# EAGLE design shinobi_pwm_alpha (EAGLE 9.6.0)
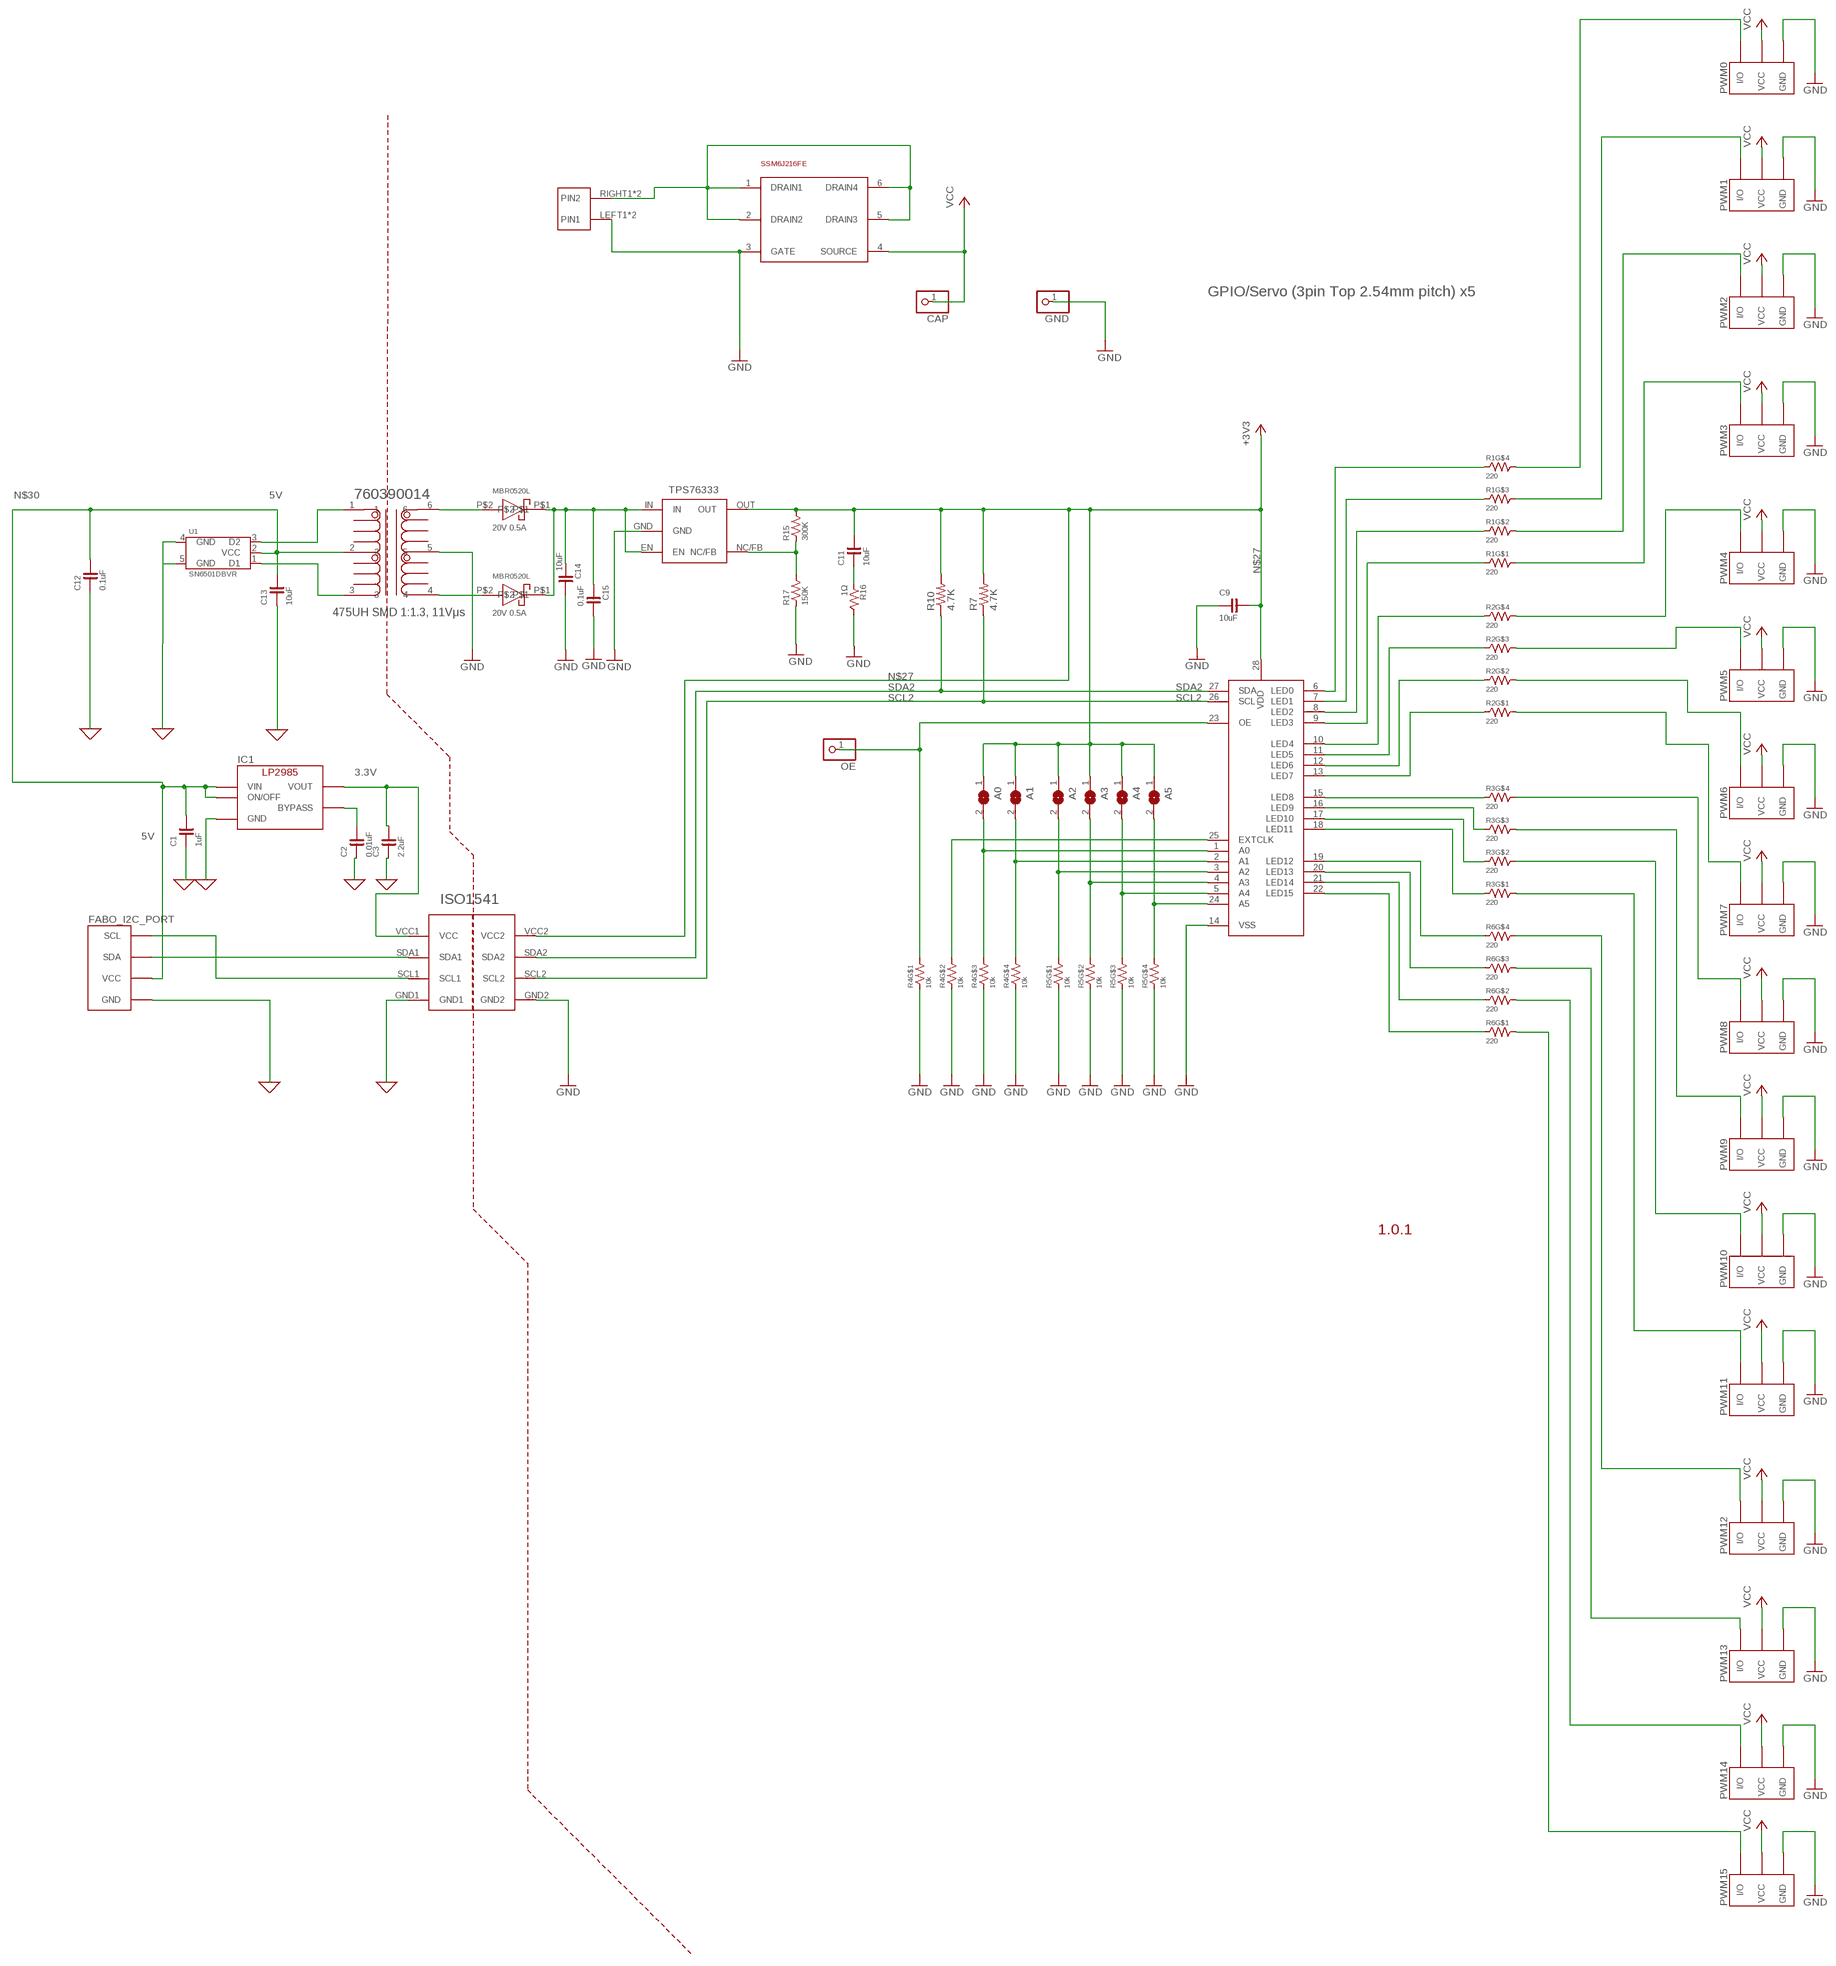
[diagram p0: schematic, sheet 1]

## Parts
A0  SJ  [SJ]
A1  SJ  [SJ]
A2  SJ  [SJ]
A3  SJ  [SJ]
A4  SJ  [SJ]
A5  SJ  [SJ]
C1  1uF  CAPACITOR-0603  [0603]
C2  0.01uF  CAPACITOR-0603  [0603]
C3  2.2uF  CAPACITOR-0603  [0603]
C9  10uF  CAPACITOR-0603  [0603]
C11  10uF  CAPACITOR-0603  [0603]
C12  0.1uF  CAPACITOR-0603  [0603]
C13  10uF  CAPACITOR-0603  [0603]
C14  10uF  CAPACITOR-0603  [0603]
C15  0.1uF  CAPACITOR-0603  [0603]
CAP  PINHD-1X1  [1X01]
D1  MBR0520L  [MBR0502L]
D2  MBR0520L  [MBR0502L]
FABO_I2C_PORT  FABO-I2C_BM04B  [I2C-BM04B-PASS-1]
GND  PINHD-1X1  [1X01]
IC1  LP2985-33DBV  [SOT-23-5]
OE  PINHD-1X1  [1X01]
PCA9685  PCA9685  [PCA9685]
PWM0  FABO_BRICK_3PIN-HEADER  [FABO_BRICK_3PIN_HEADER]
PWM1  FABO_BRICK_3PIN-HEADER  [FABO_BRICK_3PIN_HEADER]
PWM2  FABO_BRICK_3PIN-HEADER  [FABO_BRICK_3PIN_HEADER]
PWM3  FABO_BRICK_3PIN-HEADER  [FABO_BRICK_3PIN_HEADER]
PWM4  FABO_BRICK_3PIN-HEADER  [FABO_BRICK_3PIN_HEADER]
PWM5  FABO_BRICK_3PIN-HEADER  [FABO_BRICK_3PIN_HEADER]
PWM6  FABO_BRICK_3PIN-HEADER  [FABO_BRICK_3PIN_HEADER]
PWM7  FABO_BRICK_3PIN-HEADER  [FABO_BRICK_3PIN_HEADER]
PWM8  FABO_BRICK_3PIN-HEADER  [FABO_BRICK_3PIN_HEADER]
PWM9  FABO_BRICK_3PIN-HEADER  [FABO_BRICK_3PIN_HEADER]
PWM10  FABO_BRICK_3PIN-HEADER  [FABO_BRICK_3PIN_HEADER]
PWM11  FABO_BRICK_3PIN-HEADER  [FABO_BRICK_3PIN_HEADER]
PWM12  FABO_BRICK_3PIN-HEADER  [FABO_BRICK_3PIN_HEADER]
PWM13  FABO_BRICK_3PIN-HEADER  [FABO_BRICK_3PIN_HEADER]
PWM14  FABO_BRICK_3PIN-HEADER  [FABO_BRICK_3PIN_HEADER]
PWM15  FABO_BRICK_3PIN-HEADER  [FABO_BRICK_3PIN_HEADER]
R1  220  RESISTOR_ARRAY  [EXBV8V]
R2  220  RESISTOR_ARRAY  [EXBV8V]
R3  220  RESISTOR_ARRAY  [EXBV8V]
R4  10k  RESISTOR_ARRAY  [EXBV8V]
R5  10k  RESISTOR_ARRAY  [EXBV8V]
R6  220  RESISTOR_ARRAY  [EXBV8V]
R7  4.7K  R-US_R0402  [R0402]
R10  4.7K  R-US_R0402  [R0402]
R15  300K  RESISTOR-0603  [0603]
R16  1Ω  RESISTOR-0603  [0603]
R17  150K  RESISTOR-0603  [0603]
SSM6J216FE  SSM6J216FE  [SSM6J216FE]
U1  SN6501DBVR  [SOT-23-5]
U$5  ML-1400-S1  [ML-1400-S1]
U$6  760390014  [760390014]
U$8  TPS76333  [TPS76333]
U$18  ISO1541  [ISO1541]

## Nets
0: C1.1 C2.1 C3.1 C12.1 C13.1 FABO_I2C_PORT.GND IC1.2(GND) U1.4(GND) U1.5(GND) U$18.GND1 ; supply symbol labelled GND
GND: C9.1 C14.2 C15.2 GND.1 PCA9685.14(VSS) PWM0.GND PWM1.GND PWM2.GND PWM3.GND PWM4.GND PWM5.GND PWM6.GND PWM7.GND PWM8.GND PWM9.GND PWM10.GND PWM11.GND PWM12.GND PWM13.GND PWM14.GND PWM15.GND R4.1 R4.2 R4.3 R4.4 R5.1 R5.2 R5.3 R5.4 R16.2 R17.1 SSM6J216FE.3(GATE) U$5.LEFT1(PIN1) U$5.LEFT2(PIN1) U$6.5 U$8.GND U$18.GND2
N$1: OE.1 PCA9685.23(OE) R4.8
N$2: PCA9685.25(EXTCLK) R4.7
N$3: A0.2 PCA9685.1(A0) R4.6
N$4: A1.2 PCA9685.2(A1) R4.5
N$5: A2.2 PCA9685.3(A2) R5.8
N$6: A3.2 PCA9685.4(A3) R5.7
N$7: A4.2 PCA9685.5(A4) R5.6
N$8: A5.2 PCA9685.24(A5) R5.5
N$9: PCA9685.6(LED0) R1.4
N$10: PCA9685.7(LED1) R1.3
N$11: PCA9685.8(LED2) R1.2
N$12: PWM4.I/O R2.5
N$13: PCA9685.10(LED4) R2.4
N$14: PCA9685.11(LED5) R2.3
N$15: PCA9685.12(LED6) R2.2
N$16: PCA9685.13(LED7) R2.1
N$17: PCA9685.9(LED3) R1.1
N$18: PCA9685.16(LED9) R3.3
N$19: PCA9685.17(LED10) R3.2
N$20: PCA9685.18(LED11) R3.1
N$21: PCA9685.19(LED12) R6.4
N$22: PCA9685.20(LED13) R6.3
N$23: PCA9685.21(LED14) R6.2
N$24: PCA9685.22(LED15) R6.1
N$25: PWM11.I/O R3.8
N$26: C11.1 R16.1
N$27: A0.1 A1.1 A2.1 A3.1 A4.1 A5.1 C9.2 C11.2 PCA9685.28(VDD) R7.2 R10.2 R15.2 U$8.OUT U$18.VCC2 ; supply symbol labelled +3V3
N$29: SSM6J216FE.1(DRAIN1) SSM6J216FE.2(DRAIN2) SSM6J216FE.5(DRAIN3) SSM6J216FE.6(DRAIN4) U$5.RIGHT1(PIN2) U$5.RIGHT2(PIN2)
N$30: C1.2 C12.2 C13.2 FABO_I2C_PORT.5V(VCC) IC1.1(VIN) IC1.3(ON/OFF) U1.2(VCC) U$6.2
N$31: PWM0.I/O R1.5
N$33: PWM1.I/O R1.6
N$34: PWM2.I/O R1.7
N$35: PCA9685.15(LED8) R3.4
N$36: PWM3.I/O R1.8
N$37: PWM5.I/O R2.6
N$38: PWM6.I/O R2.7
N$39: PWM7.I/O R2.8
N$40: PWM8.I/O R3.5
N$41: PWM9.I/O R3.6
N$42: PWM10.I/O R3.7
N$43: PWM12.I/O R6.5
N$44: PWM13.I/O R6.6
N$45: PWM14.I/O R6.7
N$46: PWM15.I/O R6.8
N$47: D1.P$2 U$6.6
N$48: U1.3(D2) U$6.1
N$49: U1.1(D1) U$6.3
N$50: C14.1 C15.1 D1.P$1 D2.P$1 U$8.EN U$8.IN
N$51: D2.P$2 U$6.4
N$52: C2.2 IC1.4(BYPASS)
N$53: C3.2 IC1.5(VOUT) U$18.VCC1(VCC)
N$55: R15.1 R17.2 U$8.NC/FB
SCL1: FABO_I2C_PORT.SCL U$18.SCL1
SCL2: PCA9685.26(SCL) R7.1 U$18.SCL2
SDA1: FABO_I2C_PORT.SDA U$18.SDA1
SDA2: PCA9685.27(SDA) R10.1 U$18.SDA2
VCC: CAP.1 PWM0.VCC PWM1.VCC PWM2.VCC PWM3.VCC PWM4.VCC PWM5.VCC PWM6.VCC PWM7.VCC PWM8.VCC PWM9.VCC PWM10.VCC PWM11.VCC PWM12.VCC PWM13.VCC PWM14.VCC PWM15.VCC SSM6J216FE.4(SOURCE)

## Notes on the sheet
- GPIO/Servo (3pin Top 2.54mm pitch) x5
- 5V
- 3.3V
- 5V
- 1.0.1

## Library data of the parts
A0 A1-A5 = jumper:SJ: SMD solder JUMPER
C1-C3 C9 C11-C15 = FaBo-Capacitor:CAPACITOR: CAPACITOR
CAP GND OE = pinhead:PINHD-1X1: PIN HEADER
D1 D2 = FaBo:MBR0520L
FABO_I2C_PORT = FaBo-Connetor:FABO-I2C
IC1 = FaBo-Supply:LP2985: LP2985
PCA9685 = FaBo-Motor:PCA9685
PWM0 PWM1-PWM15 = FaBo-Template:FABO_BRICK_3PIN: FaBo Brick 3pin
R1-R6 = component:RESISTOR_ARRAY
R7 R10 = rcl:R-US_: RESISTOR, American symbol; SPICEPREFIX: R
R15-R17 = FaBo-Resistors:RESISTOR: RESISTOR
SSM6J216FE = FaBo-Supply:SSM6J216FE
U1 = TI:SN6501
U$5 = FaBo-Terminal:ML-1400-S1
U$6 = FaBo:760390014
U$8 = FaBo:TPS76333
U$18 = FaBo:ISO1541

## Board
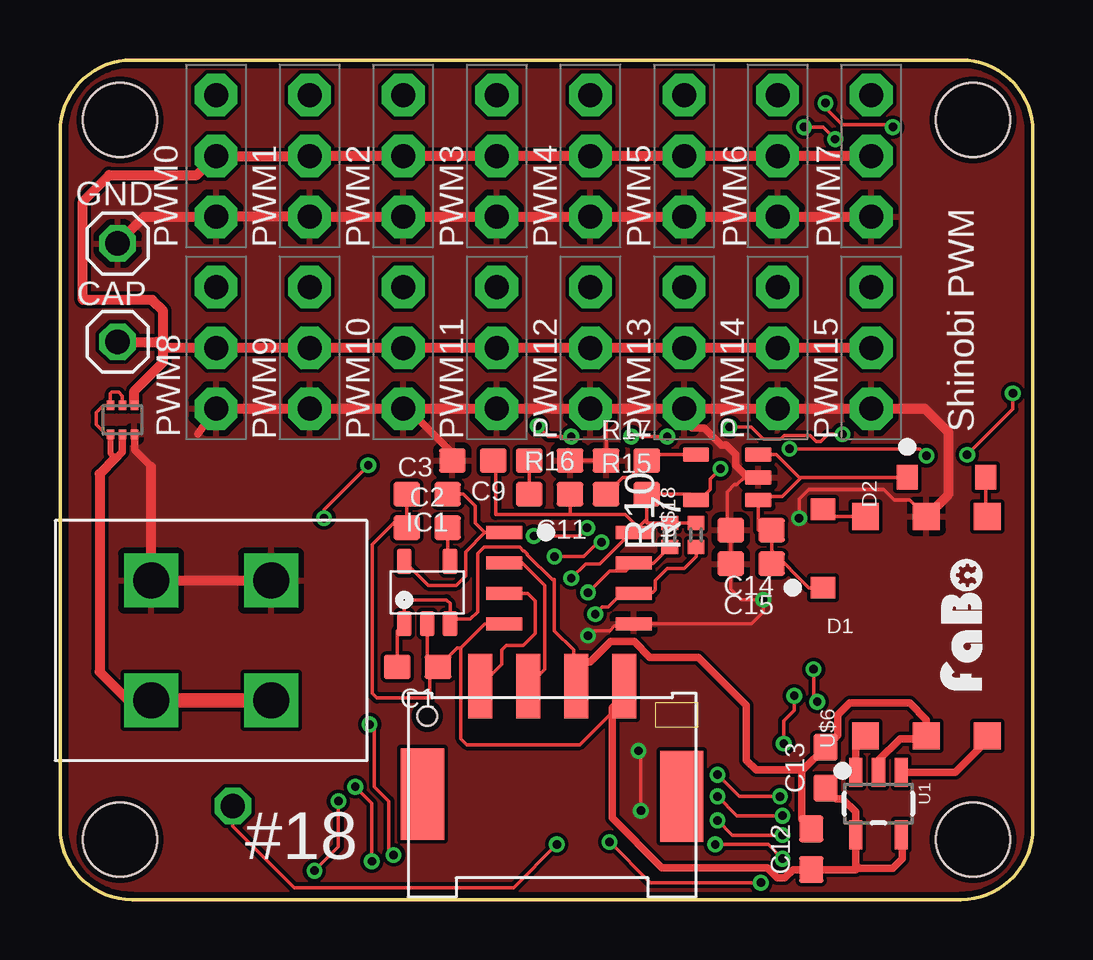
[diagram p1: board, top side]
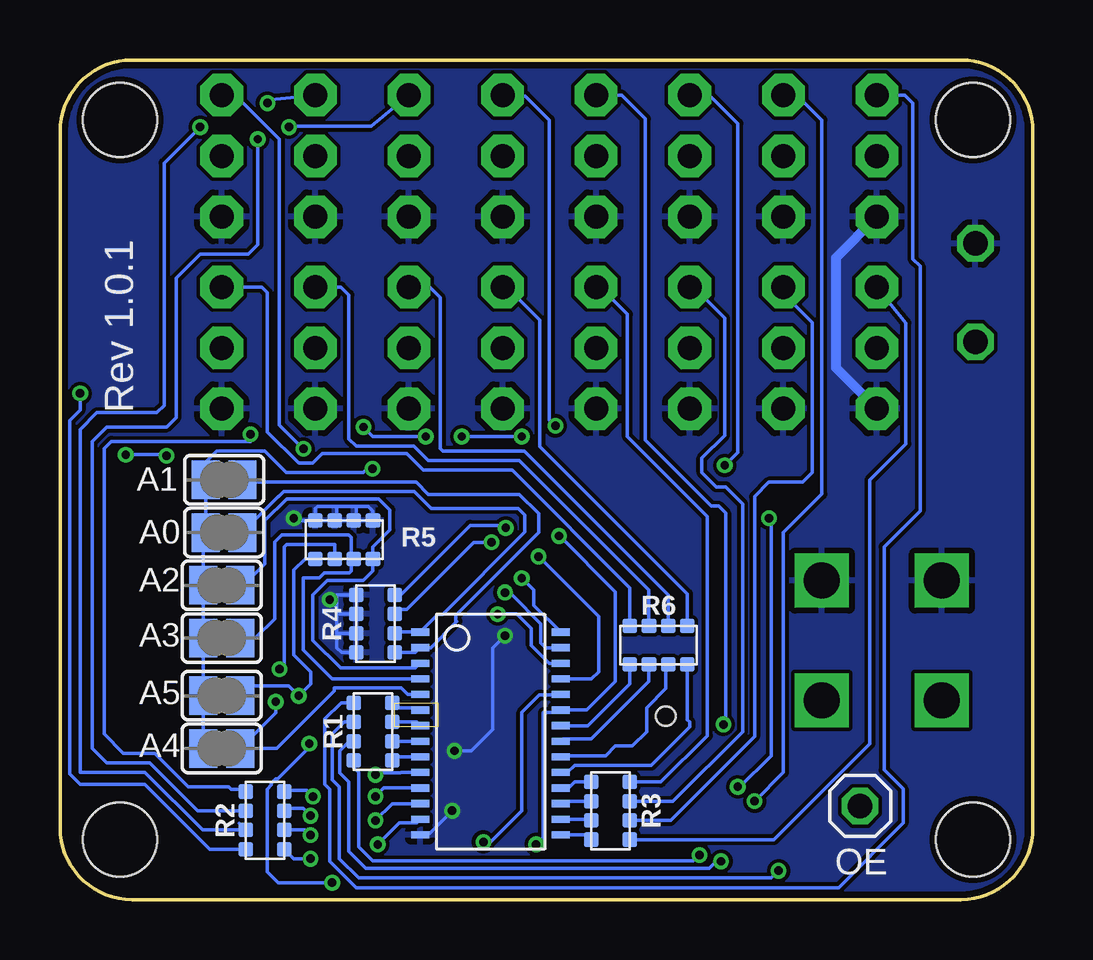
[diagram p2: board, bottom side, seen from below]

Size 40.54 x 35 mm. Coordinates in mm from the lower left corner, seen from the top.
Copper layers (1*16): Top 0.035mm / dielectric 1.5mm / Bottom 0.035mm
Design rules "SeeedStudio_2layer_DRU_no_angle_20140221": minimum track width 6mil, minimum drill 12mil, track to track 6mil, track to pad 6mil, pad to pad 6mil, via to via 6mil, smd to smd 0mil, copper to edge 10mil, drill to drill 10mil, minimum pad ring 10mil, minimum via ring 6mil, stop-mask expansion 2mil, vias tented up to drill 100mil, thermal gap 10mil

### Footprints (pad centres in the part's own frame; a part is rotated, then mirrored left to right if it is on the bottom)
SJ = smd 1.168 x 1.6: 1 -0.762,0; 2 0.762,0
0603 = smd 1.1 x 1: 1 -0.85,0; 2 0.85,0
1X01 = drill 1.016 octagon: 1 0,0
MBR0502L = smd 1.02 x 0.88: P$1 0,0; P$2 0,-3.27
I2C-BM04B-PASS-1 = smd 1 x 2.7: 5V -1,0; GND -3,0; SCL 3,0; SDA 1,0 | smd 1.8 x 3.8: P$5 -5.4,4.6; P$6 5.4,4.5 | hole 0.8: 5.2,1.25
SOT-23-5 = smd 0.6 x 1.05: 1 -0.95,-1.3; 2 0,-1.3; 3 0.95,-1.3; 4 0.95,1.3; 5 -0.95,1.3
PCA9685 = smd 0.3 x 0.75: 1 -4.15,-2.93; 2 -3.5,-2.93; 3 -2.85,-2.93; 4 -2.2,-2.93; 5 -1.55,-2.93; 6 -0.9,-2.93; 7 -0.25,-2.93; 8 0.4,-2.93; 9 1.05,-2.93; 10 1.7,-2.93; 11 2.35,-2.93; 12 3,-2.93; 13 3.65,-2.93; 14 4.3,-2.93; 15 4.3,2.92; 16 3.65,2.92; 17 3,2.92; 18 2.35,2.92; 19 1.7,2.92; 20 1.05,2.92; 21 0.4,2.92; 22 -0.25,2.92; 23 -0.9,2.92; 24 -1.55,2.92; 25 -2.2,2.92; 26 -2.85,2.92; 27 -3.5,2.92; 28 -4.15,2.92
FABO_BRICK_3PIN_HEADER = drill 1 pad 1.778 octagon: GND -2.54,0; I/O 2.54,0; VCC 0,0
EXBV8V = smd 0.6 x 0.6: 1 -1.2,-0.8; 2 -0.4,-0.8; 3 0.4,-0.8; 4 1.2,-0.8; 5 1.2,0.8; 6 0.4,0.8; 7 -0.4,0.8; 8 -1.2,0.8
R0402 = smd 0.6 x 0.7: 1 -0.5,0; 2 0.5,0
SSM6J216FE = smd 0.3 x 0.4: 1 -0.5,-0.6; 2 0,-0.6; 3 0.5,-0.6; 4 0.5,0.6; 5 0,0.6; 6 -0.5,0.6
SOT-23-5' = smd 1.2 x 0.55: 1 -1.3,0.95; 2 -1.3,0; 3 -1.3,-0.95; 4 1.3,-0.95; 5 1.3,0.95
FABO-SHINOBI = hole 3.1: 2.5,32.5; 38.04,32.5; 38.04,2.5; 2.5,2.5
ML-1400-S1 = drill 1.5 square: LEFT1 -2.5,2.5; LEFT2 -2.5,-2.5; RIGHT1 2.5,2.5; RIGHT2 2.5,-2.5
760390014 = smd 1.12 x 1.118: 1 -4.57,2.54; 2 -4.57,0; 3 -4.57,-2.54; 4 4.57,-2.54; 5 4.57,0; 6 4.57,2.54
TPS76333 = smd 1.1 x 0.6: EN -1.3,-0.95; GND -1.3,0; IN -1.3,0.95; NC/FB 1.3,-0.95; OUT 1.3,0.95
ISO1541 = smd 0.55 x 1.5: GND1 1.905,-2.7; GND2 1.905,2.7; SCL1 0.635,-2.7; SCL2 0.635,2.7; SDA1 -0.635,-2.7; SDA2 -0.635,2.7; VCC1 -1.905,-2.7; VCC2 -1.905,2.7

### Placement (x,y rotation side)
A0  33.7,15.3 0 bottom
A1  33.7,17.5 0 bottom
A2  33.8,13.1 0 bottom
A3  33.8,10.9 0 bottom
A4  33.8,6.3 0 bottom
A5  33.8,8.5 0 bottom
C1  14.9,9.7 180 top
C2  15.3,15.5 0 top
C3  15.3,16.9 0 top
C9  17.2,18.3 0 top
C11  20.4,16.9 0 top
C12  31.3,2.1 90 top
C13  31.9,5.5 90 top
C14  28.8,15.4 180 top
C15  28.8,14 180 top
CAP  2.4,23.25 0 top
D1  31.8,13 180 top
D2  35.3,17.6 90 top
FABO_I2C_PORT  20.5,8.9 180 top
GND  2.4,27.35 0 top
IC1  15.3,12.8 0 top
OE  7.2,3.9 0 bottom
PCA9685  22.6,7 270 bottom
PWM0  6.5,31 90 top
PWM1  10.4,31 90 top
PWM2  14.3,31 90 top
PWM3  18.2,31 90 top
PWM4  22.1,31 90 top
PWM5  26,31 90 top
PWM6  29.9,31 90 top
PWM7  33.8,31 90 top
PWM8  6.5,23 90 top
PWM9  10.4,23 90 top
PWM10  14.3,23 90 top
PWM11  18.2,23 90 top
PWM12  22.1,23 90 top
PWM13  26,23 90 top
PWM14  29.9,23 90 top
PWM15  33.8,23 90 top
R1  27.5,7 90 bottom
R2  32,3.3 90 bottom
R3  17.6,3.7 270 bottom
R4  27.4,11.5 270 bottom
R5  28.7,15 180 bottom
R6  15.6,10.6 0 bottom
R7  26.5,15.2 90 top
R10  25.4,15.2 90 top
R15  23.6,16.9 0 top
R16  20.4,18.3 0 top
R17  23.6,18.3 0 top
SSM6J216FE  2.6,20 0 top
U1  SN6501DBVR  [SOT-23-5']  34.1,4 270 top
U$1  [FABO-SHINOBI]  0,0 0 top
U$2  [LOGO_FABO_S]  38.58,11.52 90 top
U$5  6.3,10.8 270 top
U$6  36.1,11.4 90 top
U$8  27.8,17.6 180 top
U$18  21.2,13.4 270 top

### Tracks (layer width: path | path; a pad name or v marks a point on that pad's centre or on a via)
0
  Top 0.152: 31.15,1.4 C12.1 31.12,1.07 31.05,1 | 23.5,8.5 FABO_I2C_PORT.GND | C1.1 15.3,10.15 IC1.2 | 16.7,10.5 16.7,6.7 16.95,6.45 21.65,6.45 23,7.8 | C3.1 14.45,15.7 | 14.45,15.7 C2.1 | C1.1 16.55,10.5 16.7,10.5 | C1.1 15.4,9.35 15.4,8.4 13.2,8.4 13,8.6 13,14.8 13.9,15.7 14.45,15.7 | 16.7,10.5 17.7,11.49 U$18.GND1
  Top 0.305: 31.25,1.2 31.12,1.07 | 23.6,8.8 FABO_I2C_PORT.GND | 33.25,1.35 33.15,1.45 U1.4 33.15,3.65 32.6,4.2 32.35,4.2 C13.1 | 33.25,1.35 33.3,1.3 34.7,1.3 35.1,1.7 35.1,2.65 U1.5 | 33.25,1.35 33.15,1.25 C12.1 30.55,1.25 30.2,0.9 29.89,0.9 29.46,1.33 25.07,1.33 23,3.4 23,7.8 23,8 23.5,8.5
GND  (via drill 0.35)
  Top 0.152: 29.1,17.4 U$8.GND 28.5,17.6 28.2,17.3 28.1,17.3 27.8,17 27.8,15.55 C14.2 C15.2 27.95,12.95 28.4,12.5 v29.3,12.5 29.3,12 28.8,11.49 U$18.GND2 | 36.5,16.37 U$6.5 35.41,16.66 34.77,16.66 34.33,17.1 31.2,17.1 30.8,16.7 v30.8,15.9 | 24.41,11.49 U$18.GND2 | R16.2 22.55,18.3 22.68,18.18 | 22.75,20.41 22.7,20.46 | v24.2,3.7 24.2,6.1 v24.1,6.2 | v22,11 22.2,11.2 22.9,11.2 23.1,11.4 23.8,11.4 U$18.GND2 | R17.1 22.75,19.91 22.2,20.46
  Top 0.305: PWM8.GND 5.74,19.4 | PWM10.GND 14.77,20.39 14.7,20.26 16.35,18.61 C9.1 | 22.5,18.35 22.68,18.18 22.68,18.23 R17.1 | U$8.GND 28.65,17.6 28.15,18.1 28.15,18.55 27.75,18.95 27.55,18.95 26.85,19.65 26.35,19.65 26.2,19.8 PWM13.GND | 3.9,13.4 U$5.LEFT2 | SSM6J216FE.3 3.11,18.74 3.8,18.05
  Top 0.406: PWM7.GND PWM6.GND PWM5.GND PWM4.GND PWM3.GND PWM2.GND PWM1.GND PWM0.GND 3.51,28.46 GND.1 | U$6.5 37,16.87 37,19.5 36.04,20.46 PWM15.GND PWM14.GND PWM13.GND PWM12.GND | PWM8.GND PWM9.GND 14.7,20.46 14.77,20.39 | PWM10.GND PWM11.GND 19.89,20.46 19.92,20.48 20.48,20.48 20.51,20.46 PWM12.GND | 22.2,20.46 PWM12.GND | U$5.LEFT1 U$5.LEFT2 3.8,18.05
  Bottom 0.152: R4.1 29,12.7 29,12.2 | 29,12.2 29,11.9 | 29,11.9 29,11.1 | R4.3 29,11.1 | R4.2 29,11.9 | 28.2,16.39 29,16.39 | 29,16.39 29.8,16.39 29.9,16.3 R5.4 30.7,15.8 v30.8,15.9 | R5.3 29,15.9 29,16.39 | R5.2 28.2,15.9 28.2,16.39 | PCA9685.14 25.2,2.7 v24.2,3.7 | v22,11 22.5,10.5 22.5,7.1 23.4,6.2 v24.1,6.2 | 29,12.2 v29.3,12.5 | R4.4 28.8,10.3 29,10.5 29,11.1 | R5.1 27.5,16.2 27.7,16.39 28.2,16.39
  Bottom 0.406: PWM8.GND 8.2,22.16 8.2,26.76 PWM0.GND
  pour Bottom: 0.4,0.3 40.2,0.3 40.2,34.6 0.4,34.6
  pour Top: 0.4,0.3 40.2,0.3 40.2,34.6 0.4,34.6
N$1  (via drill 0.35)
  Top 0.152: v19.74,15.16 21.63,15.16 v21.97,15.49 | v20.7,2.3 18.9,0.5 9.75,0.5 7.2,3.05 OE.1
  Bottom 0.152: 19.74,15.17 17.4,12.83 17.4,9.1 18.6,7.9 PCA9685.23 19.78,7.8 20.4,7.8 20.4,2.6 v20.7,2.3 | 26.7,12.7 R4.8 26.35,12.7 23.46,15.59 22.07,15.59 v21.97,15.49 | 19.77,15.2 19.74,15.17 | 19.74,15.17 v19.74,15.16
N$2  (via drill 0.35)
  Top 0.152: v20.6,14.3 21.81,14.3 22.41,14.89 v22.56,14.89
  Bottom 0.152: PCA9685.25 18.4,9.2 18.1,9.5 18.1,11.8 v20.6,14.3 | 26.4,11.9 R4.7 26.4,12.1 26.1,12.1 23.31,14.89 v22.56,14.89
N$3
  Bottom 0.152: R4.6 26.55,11.15 PCA9685.1 24.8,11.88 24.6,11.88 21.17,15.32 21.17,16.03 21.44,16.3 25.07,16.3 25.77,17 31.23,17 31.43,16.8 31.44,16.8 A0.2
N$4
  Bottom 0.152: R4.5 25.73,10.3 PCA9685.2 25.1,10.5 24.05,11.55 | A1.2 32.84,17.4 25.7,17.4 25.2,16.89 21.39,16.89 20.6,16.1 20.6,15.3 24.05,11.85 24.05,11.55 | 24.05,11.55 24,11.6
N$5
  Bottom 0.152: PCA9685.3 25.73,9.65 28.85,9.65 30,10.8 30,12.7 29.4,13.3 27.9,13.3 27.5,13.7 R5.8 27.5,14.7 26.8,15.4 26.8,16.25 27.25,16.7 31.1,16.7 32,15.8 32,14 32.9,13.1 A2.2
N$6
  Bottom 0.152: PCA9685.4 29.2,9.2 30.4,10.4 30.4,13.4 29.73,13.4 29.53,13.61 28.5,13.61 28.4,13.7 28.4,14.1 R5.7 | 28.5,14.2 R5.7 | R5.7 28.4,14.3 28.4,15.1 28.5,15.21 30.83,15.21 30.83,15.2 31.3,15.2 31.6,14.9 31.6,11.7 32.4,10.9 A3.2
N$7  (via drill 0.35)
  Top 0.152: v31.4,9.6 31.4,8.39 v31.55,8.24
  Bottom 0.152: R5.6 29.1,14.8 31.1,14.8 31.2,14.7 31.2,9.8 v31.4,9.6 | PCA9685.5 26.05,8.55 26.33,8.83 29.11,8.83 29.11,8.69 31.5,6.3 A4.2 31.55,7.79 v31.55,8.24
N$8  (via drill 0.35)
  Top 0.152: v22.9,2.4 24.59,0.71 v29.19,0.71 v29.2,0.7 | v30.16,6.5 30.16,7.46 30.59,7.89 v30.59,8.49
  Bottom 0.152: PCA9685.24 19.7,8.53 20.57,8.53 21.3,7.8 21.3,3.7 22.6,2.4 v22.9,2.4 | v29.2,0.7 v29.21,0.71 31.46,0.71 31.9,1.15 31.9,4.6 31.73,4.77 31.73,4.84 31.54,5.03 31.47,5.03 30.16,6.34 v30.16,6.5 | R5.5 30.33,14.2 30.8,13.73 30.8,10.2 30.1,9.5 30.1,8.99 v30.59,8.49 31,8.9 32.64,8.9 A5.2 33.04,8.3 | 33.04,8.16 33.04,8.3 | 32.54,8.8 33.04,8.3
N$9
  Bottom 0.152: PCA9685.6 25.63,8 26.5,8 R1.4
N$10
  Bottom 0.152: PCA9685.7 25.68,7.4 R1.3
N$11
  Bottom 0.152: PCA9685.8 R1.2
N$12  (via drill 0.35)
  Top 0.152: v19.9,19.75 20.35,19.3 v21.3,19.3 | v25.3,19.3 v23.8,19.3 | v27.9,19.7 28.8,19.7 29.3,19.2 30.03,19.2 30.17,19.34 31.26,19.34 31.51,19.09 31.7,19.09 32.01,19.4 v32.6,19.4
  Bottom 0.152: PWM4.I/O 22.48,33.5 21.15,33.5 20.15,32.5 20.15,20 v19.9,19.75 | R2.5 32.9,4.6 33.4,4.6 33.5,4.7 35.2,4.7 36.6,6.1 37.9,6.1 38.7,6.9 38.7,18.8 38.4,19.1 32.6,19.1 v32.6,19.4 | v21.3,19.3 v23.8,19.3 | v25.3,19.3 27.5,19.3 v27.9,19.7
N$13  (via drill 0.35)
  Top 0.152: v27.4,5.2 28.3,4.3 v30,4.3
  Bottom 0.152: v27.4,5.2 27.3,5.3 27.07,5.3 27.04,5.27 26.36,5.27 26.33,5.3 PCA9685.10 | R2.4 31.15,4.55 30.25,4.55 v30,4.3
N$14  (via drill 0.35)
  Top 0.152: v27.4,4.3 28.21,3.49 v30.1,3.49
  Bottom 0.152: PCA9685.11 27.05,4.65 v27.4,4.3 | 30.99,3.49 R2.3 31.1,3.8 30.41,3.8 v30.1,3.49
N$15  (via drill 0.35)
  Top 0.152: v27.4,3.3 28.01,2.69 v30.1,2.69
  Bottom 0.152: PCA9685.12 26.7,4 v27.4,3.3 | v30.1,2.69 30.31,2.9 R2.2
N$16  (via drill 0.35)
  Top 0.152: v27.3,2.3 29.5,2.3 v30.1,1.7
  Bottom 0.152: PCA9685.13 25.68,3.2 26.4,3.2 v27.3,2.3 | v30.1,1.7 30.8,1.7 R2.1
N$17
  Bottom 0.152: R1.1 26.55,5.95 PCA9685.9
N$18
  Bottom 0.152: PCA9685.16 18.45,3.35 R3.3
N$19
  Bottom 0.152: 19.46,4 PCA9685.17 19.58,4.1 R3.2
N$20
  Bottom 0.152: R3.1 19.1,4.9 19.35,4.65 PCA9685.18
N$21
  Bottom 0.152: PCA9685.19 19.4,5.3 19.1,5.6 15.9,5.6 14.3,7.2 14.3,7.4 14.4,7.5 R6.4
N$22
  Bottom 0.152: PCA9685.20 19.65,5.95 19.6,6 17.8,6 17.4,6.4 16.7,6.4 16.1,7 16.1,8 15.3,8.8 15.3,9.7 R6.3
N$23
  Bottom 0.152: PCA9685.21 19.58,6.7 18.4,6.7 16,9.1 R6.2
N$24
  Bottom 0.152: R6.1 16.8,9 18.55,7.25 PCA9685.22
N$25
  Bottom 0.152: PWM11.I/O 18.16,25.1 17.6,25.1 16.9,24.4 16.9,19.3 13.57,15.97 13.57,6.83 15.5,4.9 R3.8
N$26
  Top 0.152: R16.1 C11.1
N$27  (via drill 0.35)
  Top 0.152: U$8.OUT 26.25,16.9 R15.2 24.45,15.86 | U$8.OUT 26.3,16.45 | U$18.VCC2 24.45,15.86 | 24.45,15.86 24.45,15.7 R10.2 R7.2 | U$18.VCC2 23.9,15.7 23.55,16.05 21.25,16.05 | 21.25,16.05 C11.2 | 21.25,16.05 18.15,16.05 18.15,18.2 C9.2 | U$8.OUT 26.57,16.57 27.1,17.1 27.1,17.54 v27.52,17.96 | v21.3,13.4 21.9,14 22.5,14 23.8,15.3 U$18.VCC2
  Bottom 0.152: PCA9685.28 20.8,12.27 20.8,12.9 v21.3,13.4 | v27.52,17.96 27.75,17.96 27.9,17.8 31.11,17.8 32,18.7 34,18.7 34.46,18.24 A1.1 A0.1 34.56,15.2 A2.1 A3.1 A5.1 A4.1
N$29
  Top 0.152: SSM6J216FE.1 1.9,19.4 1.5,19.8 1.5,20.3 1.8,20.6 SSM6J216FE.6 2.1,21.1 2.15,21.15 2.45,21.15 2.6,21 SSM6J216FE.5
  Top 0.254: SSM6J216FE.1 2.1,18.6 2.3,18.4 2.33,18.38
  Top 0.305: SSM6J216FE.2 2.6,18.65 2.33,18.38
  Top 0.406: 2.3,18.4 1.65,17.75 1.65,9.5 2.85,8.3 4.1,8.3
  Top 0.61: U$5.RIGHT2 4.1,8.3 U$5.RIGHT1
N$30
  Top 0.152: FABO_I2C_PORT.5V 21.6,9 | FABO_I2C_PORT.5V 21.1,8.5 | 36.1,6.63 36.1,6.7 U$6.2 | C1.2 14.05,11.2 IC1.1 14.35,12.25 14.6,12.5 16.1,12.5 16.25,12.35 IC1.3 16.45,11.7 17.1,11.7 17.4,12 17.4,14.43 17.67,14.7 19.15,14.7 19.31,14.54 19.34,14.54 19.48,14.4 19.48,14.37 20.5,13.35 20.6,13.35 20.6,11.2 21.4,10.4 21.4,9.9 21.4,9 FABO_I2C_PORT.5V
  Top 0.2: 36.2,6.53 36.1,6.63
  Top 0.305: 31.55,2.7 C12.2 30.9,3.35 30.9,5.3 30.8,5.4 | 21.4,9.9 22.1,9.9 22.95,10.76 23.93,10.76 24.58,10.1 26.6,10.1 28.6,8.1 28.6,5.8 29,5.4 30.8,5.4 | U1.2 34.1,5.8 35,6.7 36.1,6.7 36.1,7.5 35.4,8.2 32.9,8.2 32.4,7.7 32.4,6.85 C13.2 30.95,5.4 30.8,5.4
N$31
  Bottom 0.152: PWM0.I/O 5.34,33.54 5,33.2 5,26.7 4.7,26.4 4.7,16.2 6.2,14.7 6.2,5.4 5.41,4.61 5.41,3.19 8.1,0.5 28.2,0.5 29.3,1.6 29.3,4.6 29.5,4.8 29.5,7.53 28.83,8.2 R1.5
N$33  (via drill 0.35)
  Top 0.152: v11.6,4.1 11.6,2.2 v10.6,1.2
  Bottom 0.152: v10.6,1.2 10.9,0.9 28.1,0.9 28.9,1.7 28.9,4.7 29.2,5 29.2,6.9 28.7,7.4 R1.6 | v11.6,4.1 10.4,5.3 10.4,15.3 8.8,16.9 8.8,32.5 9.65,33.35 10.81,33.35 PWM1.I/O
N$34  (via drill 0.35)
  Top 0.152: v12.3,4.7 12.99,4.01 v12.99,1.59 | v12.84,18.1 11,16.26 v11,15.9
  Bottom 0.152: PWM2.I/O 13.59,33.54 13.61,33.55 13.5,33.55 12.3,32.35 12.3,18.64 v12.84,18.1 | v12.99,1.59 13.19,1.59 13.49,1.3 27.79,1.3 28.5,2.01 28.5,4.9 28.89,5.29 28.89,6.2 28.49,6.6 R1.7 | v12.3,4.7 12.25,4.65 10.9,6 10.9,15.6 11,15.7 v11,15.9
N$35
  Bottom 0.152: PCA9685.15 18.6,2.7 R3.4
N$36  (via drill 0.35)
  Top 0.152: v12.9,7.3 13.1,7.1 13.1,4.7 13.7,4.1 13.7,2.06 v13.9,1.86
  Bottom 0.152: v12.9,7.3 12.8,7.39 12.8,16.11 13.1,16.4 13.4,16.4 16.15,19.15 16.15,32.55 17.14,33.54 PWM3.I/O | v13.9,1.86 14.15,1.6 27.5,1.6 28.1,2.2 28.1,5.3 28.3,5.5 R1.8
N$37  (via drill 0.35)
  Top 0.152: v31,32.2 31.8,32.2 v32.3,31.7
  Bottom 0.152: R2.6 34.8,3.7 36.8,5.7 38.6,5.7 39.2,6.3 39.2,19.1 38.6,19.7 36.1,19.7 35.7,20.1 35.7,25.9 34.7,26.9 32.7,26.9 32.3,27.3 v32.3,31.7 | PWM5.I/O 27.58,32.25 30.95,32.25 v31,32.2
N$38  (via drill 0.35)
  Top 0.152: v31.9,33.2 31.9,33 32.6,32.3 34.6,32.3 v34.7,32.2
  Bottom 0.152: 33.07,3.17 R2.7 34.6,2.9 37,5.3 39.7,5.3 39.7,19.6 39,20.3 36.5,20.3 36.2,20.6 36.2,30.7 v34.7,32.2 | PWM6.I/O 31.76,33.34 v31.9,33.2
N$39  (via drill 0.35)
  Top 0.152: v30.4,18.79 35.81,18.79 v36.1,18.5 | v37.8,18.54 39.7,20.44 v39.7,21.1
  Bottom 0.152: R2.8 34.3,2.1 37,4.8 39.7,4.8 40.13,5.23 40.13,19.97 39.7,20.4 v39.7,21.1 | PWM7.I/O 33.04,33.34 31.4,31.7 31.4,19.79 v30.4,18.79 | v36.1,18.5 36.14,18.54 v37.8,18.54
N$40
  Bottom 0.152: PWM8.I/O 5.3,24.04 5.3,19 6.8,17.5 6.8,6.5 10.8,2.5 R3.5
N$41
  Bottom 0.152: PWM9.I/O 10.63,25.48 9.2,24.05 9.2,17.8 9.6,17.4 11,17.4 11.6,16.8 11.6,6.8 15.1,3.3 R3.6
N$42
  Bottom 0.152: PWM10.I/O 14.14,25.54 12.85,24.25 12.85,19.35 13.8,18.4 13.8,17.8 13.2,17.2 12.8,17.2 12.1,16.5 12.1,7 15,4.1 R3.7
N$43
  Bottom 0.152: PWM12.I/O 21.93,25.54 20.54,24.15 20.54,18.89 14.4,12.75 R6.5
N$44
  Bottom 0.152: PWM13.I/O 25.14,25.54 24.7,25.1 24.7,18.8 24.6,18.7 21.2,18.7 15.2,12.7 R6.6
N$45
  Bottom 0.152: R6.7 16,12.9 21.4,18.3 25.2,18.3 25.8,18.9 28.2,18.9 28.5,19.2 28.5,25.2 28.84,25.54 PWM14.I/O
N$46
  Bottom 0.152: R6.8 16.8,13 21.7,17.9 25.4,17.9 26.09,18.59 29.61,18.59 30,18.2 30.59,18.2 31.9,19.5 31.9,25.3 32.14,25.54 PWM15.I/O
N$47
  Top 0.152: U$6.6 32.1,15.97 D1.P$2
N$48
  Top 0.152: 33.53,6.83 U$6.1
  Top 0.2: U$6.1 33.8,6.59
  Top 0.305: U1.3 33.15,6.42 U$6.1
N$49
  Top 0.2: 38.53,6.83 U$6.3
  Top 0.305: U1.1 37.3,5.3 38.64,6.64 U$6.3
N$50
  Top 0.152: D1.P$1 31.2,13 29.65,14.55 C14.1 | U$8.EN 29.85,18.55 30.8,17.6 | 30.8,17.6 30.85,17.55 30.1,16.8 29.25,16.8 U$8.IN 29.1,15.4 C14.1 | D2.P$1 30.8,17.6 | C14.1 C15.1
N$51
  Top 0.152: U$6.4 38.57,16.04 D2.P$2
N$52
  Top 0.152: IC1.4 16.15,14.2 C2.2
N$53
  Top 0.152: IC1.5 15.35,13.1 16.5,13.1 16.9,13.5 16.9,14.5 17.7,15.3 U$18.VCC1 17.7,15.3 17.3,15.7 17.3,16.4 16.8,16.9 C3.2
N$55
  Top 0.152: U$8.NC/FB 24.7,18.55 R17.2 | 24.57,18.18 R17.2 | 23,16.9 R15.1 23.45,17.6 23.75,17.6 R17.2
SCL1
  Top 0.152: 17.8,8.6 FABO_I2C_PORT.SCL 18.4,9.8 18.4,10.4 18.6,10.6 19.3,10.6 19.8,11.1 19.8,12.45 19.48,12.77 U$18.SCL1 18.07,12.77
SCL2  (via drill 0.35)
  Top 0.152: v22.3,11.9 22.6,12.2 22.84,12.2 23.4,12.77 U$18.SCL2 23.93,12.8 24.7,12.8 24.8,12.9 24.8,13.3 25.3,13.8 26,13.8 26.5,14.3 R7.1
  Bottom 0.152: 19.73,9.8 PCA9685.26 20.15,9.85 20.9,10.6 20.9,11.3 21.5,11.9 v22.3,11.9
SDA1
  Top 0.152: U$18.SDA1 19.27,14.04 20.2,13.1 20.2,9.6 FABO_I2C_PORT.SDA
SDA2  (via drill 0.35)
  Top 0.152: v22,12.8 22.9,13.7 23.57,13.7 U$18.SDA2 23.92,14.02 24.72,14.02 R10.1
  Bottom 0.152: v22,12.8 21.9,12.7 21.7,12.7 20.5,11.5 20.5,10.7 20.3,10.5 PCA9685.27
VCC
  Top 0.406: PWM7.VCC PWM6.VCC PWM5.VCC PWM4.VCC PWM3.VCC PWM2.VCC PWM1.VCC PWM0.VCC 5.7,30.2 2.05,30.2 0.95,29.1 0.95,25 3.85,25 4.3,24.55 4.3,23 | PWM15.VCC PWM14.VCC PWM13.VCC PWM12.VCC PWM11.VCC PWM10.VCC PWM9.VCC PWM8.VCC 4.3,23 | SSM6J216FE.4 3.1,21.2 4.3,22.4 4.3,23 | CAP.1 4.05,23.25 4.3,23

### Text on the board
tPlace: Shinobi PWM | #18
bPlace: Rev 1.0.1